# Altium schematic sheet SDRAM_MT48LC16M16A2TG_16Mx32.SchDoc: 16M x 32 SDRAM TSOP54 x 2
size A4; Organization: Altium Limited.; Address1: Level 3, 12a Rodborough Rd; Address2: Frenchs Forest 2086; Address3: NSW; Address4: AUSTRALIA; SheetNumber: 1; SheetTotal: 100; PageSetup: Record=PageOptions|CenterHorizontal=True|CenterVertical=True|PrintScale=0.91|XCorrection=1.00|YCorrection=1.00|PrintKind=0|BorderSize=5000000|LeftOffset=0|BottomOffset=0|Orientation=2|PaperLength=1000|PaperWidth=1000|Scale=100|PaperSource=7|PrintQuality=-4|MediaType=1|DitherType=10|PaperKind=Letter|PrintScaleMode=1
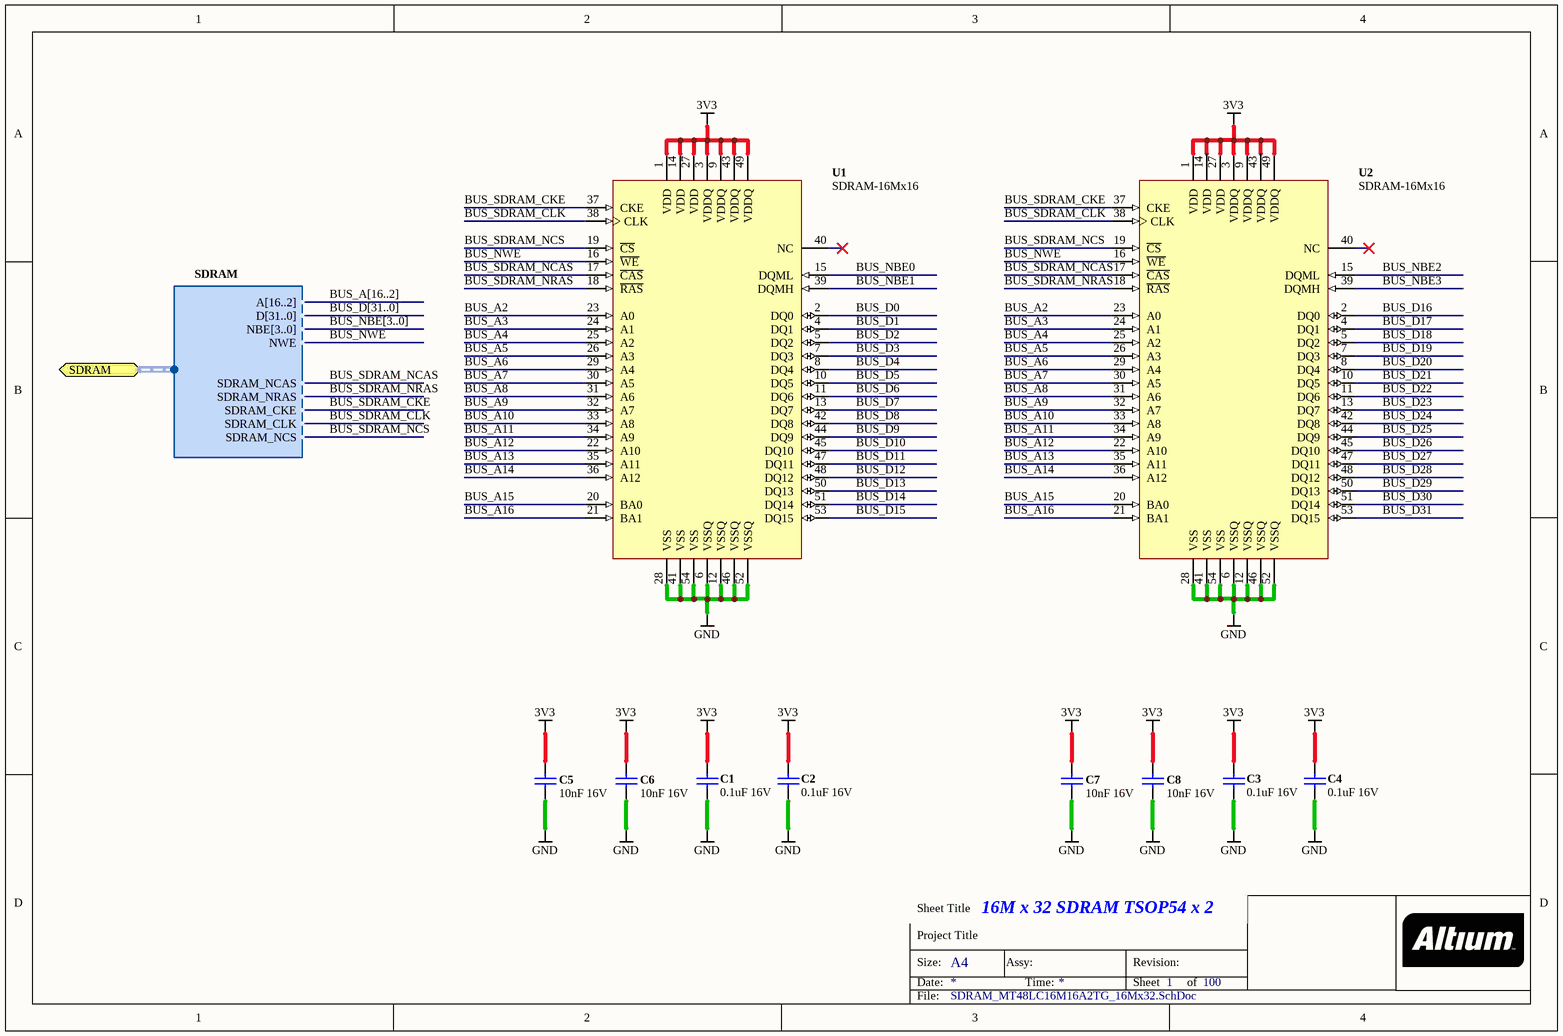
[diagram p0: SDRAM_MT48LC16M16A2TG_16Mx32.SchDoc]

## Parts
C1  0.1uF 16V  [CAPC1005-STAR]
C2  0.1uF 16V  [CAPC1005-STAR]
C3  0.1uF 16V  [CAPC1005-STAR]
C4  0.1uF 16V  [CAPC1005-STAR]
C5  10nF 16V  [CAPC1005-STAR]
C6  10nF 16V  [CAPC1005-STAR]
C7  10nF 16V  [CAPC1005-STAR]
C8  10nF 16V  [CAPC1005-STAR]
U1  SDRAM-16Mx16  [TSOP80P1176-54]
U2  SDRAM-16Mx16  [TSOP80P1176-54]

## Ports
SDRAM (harness SDRAM)

## Harnesses
SDRAM: A[16..2], D[31..0], NBE[3..0], NWE, SDRAM_NCAS, SDRAM_NRAS, SDRAM_CKE, SDRAM_CLK, SDRAM_NCS

## Nets
3V3: C1.1 C2.1 C3.1 C4.1 C5.1 C6.1 C7.1 C8.1 U1.1(VDD) U1.3(VDDQ) U1.9(VDDQ) U1.14(VDD) U1.27(VDD) U1.43(VDDQ) U1.49(VDDQ) U2.1(VDD) U2.3(VDDQ) U2.9(VDDQ) U2.14(VDD) U2.27(VDD) U2.43(VDDQ) U2.49(VDDQ)
GND: C1.2 C2.2 C3.2 C4.2 C5.2 C6.2 C7.2 C8.2 U1.6(VSSQ) U1.12(VSSQ) U1.28(VSS) U1.41(VSS) U1.46(VSSQ) U1.52(VSSQ) U1.54(VSS) U2.6(VSSQ) U2.12(VSSQ) U2.28(VSS) U2.41(VSS) U2.46(VSSQ) U2.52(VSSQ) U2.54(VSS)
BUS_A2: U1.23(A0) U2.23(A0)
BUS_A3: U1.24(A1) U2.24(A1)
BUS_A4: U1.25(A2) U2.25(A2)
BUS_A5: U1.26(A3) U2.26(A3)
BUS_A6: U1.29(A4) U2.29(A4)
BUS_A7: U1.30(A5) U2.30(A5)
BUS_A8: U1.31(A6) U2.31(A6)
BUS_A9: U1.32(A7) U2.32(A7)
BUS_A10: U1.33(A8) U2.33(A8)
BUS_A11: U1.34(A9) U2.34(A9)
BUS_A12: U1.22(A10) U2.22(A10)
BUS_A13: U1.35(A11) U2.35(A11)
BUS_A14: U1.36(A12) U2.36(A12)
BUS_A15: U1.20(BA0) U2.20(BA0)
BUS_A16: U1.21(BA1) U2.21(BA1)
BUS_D0: U1.2(DQ0)
BUS_D1: U1.4(DQ1)
BUS_D2: U1.5(DQ2)
BUS_D3: U1.7(DQ3)
BUS_D4: U1.8(DQ4)
BUS_D5: U1.10(DQ5)
BUS_D6: U1.11(DQ6)
BUS_D7: U1.13(DQ7)
BUS_D8: U1.42(DQ8)
BUS_D9: U1.44(DQ9)
BUS_D10: U1.45(DQ10)
BUS_D11: U1.47(DQ11)
BUS_D12: U1.48(DQ12)
BUS_D13: U1.50(DQ13)
BUS_D14: U1.51(DQ14)
BUS_D15: U1.53(DQ15)
BUS_D16: U2.2(DQ0)
BUS_D17: U2.4(DQ1)
BUS_D18: U2.5(DQ2)
BUS_D19: U2.7(DQ3)
BUS_D20: U2.8(DQ4)
BUS_D21: U2.10(DQ5)
BUS_D22: U2.11(DQ6)
BUS_D23: U2.13(DQ7)
BUS_D24: U2.42(DQ8)
BUS_D25: U2.44(DQ9)
BUS_D26: U2.45(DQ10)
BUS_D27: U2.47(DQ11)
BUS_D28: U2.48(DQ12)
BUS_D29: U2.50(DQ13)
BUS_D30: U2.51(DQ14)
BUS_D31: U2.53(DQ15)
BUS_NBE0: U1.15(DQML)
BUS_NBE1: U1.39(DQMH)
BUS_NBE2: U2.15(DQML)
BUS_NBE3: U2.39(DQMH)
BUS_NWE: U1.16(~{WE}) U2.16(~{WE}) ; port SDRAM.NWE
BUS_SDRAM_CKE: U1.37(CKE) U2.37(CKE) ; port SDRAM.SDRAM_CKE
BUS_SDRAM_CLK: U1.38(CLK) U2.38(CLK) ; port SDRAM.SDRAM_CLK
BUS_SDRAM_NCAS: U1.17(~{CAS}) U2.17(~{CAS}) ; port SDRAM.SDRAM_NCAS
BUS_SDRAM_NCS: U1.19(~{CS}) U2.19(~{CS}) ; port SDRAM.SDRAM_NCS
BUS_SDRAM_NRAS: U1.18(~{RAS}) U2.18(~{RAS}) ; port SDRAM.SDRAM_NRAS

Not connected (* = marked no-connect by the designer): U1 40(NC)*; U2 40(NC)*

## Buses and harness runs
bus BUS_A[16..2]
bus BUS_D[31..0]
bus BUS_NBE[3..0]

## Notes on the sheet
- Sheet Title
- Project Title
- Size:
- Date:
- A4
- Assy:
- Time:
- Revision:
- Sheet
- of
- File:

## Library data of the parts
C1-C4 = D-101-0080: Capacitor, Ceramic, 0.1uF 10% 16V 0402 (1005) X7R; Polarity: Non-Polarized; Category: Capacitor; Status: Production; Capacitance: 0.1 uF; Dielectric: X7R; Mounting Technology: Surface Mount; Rated Voltage: 16 V; Technology: Ceramic; Tolerance: 10 %
C5-C8 = D-101-0077: Capacitor, Ceramic, 10nF 10% 16V 0402 (1005) X7R; Polarity: Non-Polarized; Category: Capacitor; Status: Production; Capacitance: 10 nF; Dielectric: X7R; Mounting Technology: Surface Mount; Rated Voltage: 16 V; Technology: Ceramic; Tolerance: 10 %
U1 = D-261-0000: MT48LC16M16A2TG, 256 Mbit High-Speed CMOS SDRAM, 16Mb x 16Bit x 4 Banks, TSOP54; EnablePinSwap: False; Bit Length: Bits; Speed: ps; Supply Voltage: mV; Category: IC-SDRAM; Status: Production; Bit Width: Bits; Mounting Technology: Surface Mount
U2 = D-261-0000: MT48LC16M16A2TG, 256 Mbit High-Speed CMOS SDRAM, 16Mb x 16Bit x 4 Banks, TSOP54; Bit Length: Bits; Speed: ps; Supply Voltage: mV; Category: IC-SDRAM; Status: Production; Bit Width: Bits; Mounting Technology: Surface Mount